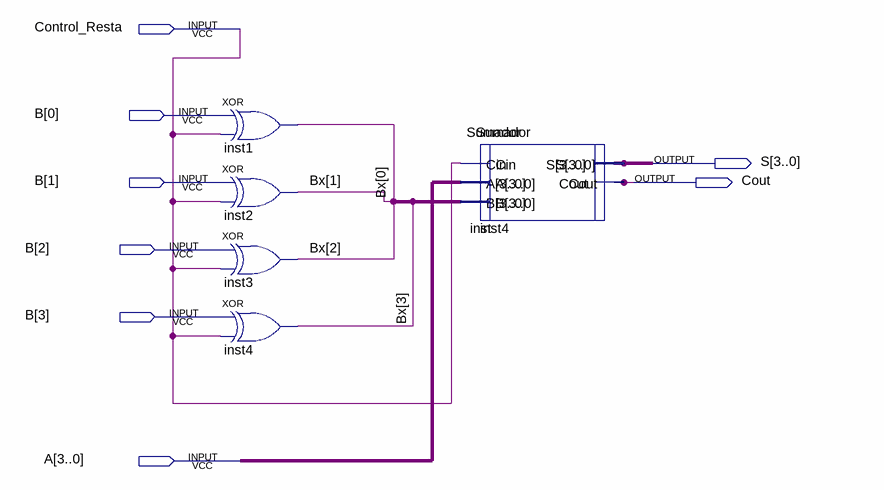
[diagram p0: schematic sheet]
// Quartus schematic Resta.bdf as structural Verilog: 6 symbols, 8 pins
module Resta (
  input  Control_Resta,
  input  [3:0] B,
  input  [3:0] A,
  output [3:0] S,
  output Cout
);

  wire [3:0] Bx, undriven;

  buf inst1 (Bx[0], Control_Resta);  // XOR open: IN1
  buf inst2 (Bx[1], Control_Resta);  // XOR open: IN1
  xor inst3 (Bx[2], B[2], Control_Resta);
  xor inst4 (Bx[3], B[3], Control_Resta);
  Sumador inst (.Cin(Control_Resta), .A(A), .B(undriven), .S(S), .Cout(Cout));
  Sumador inst4_dup2 (.S(S), .Cout(Cout));  // open: Cin, A, B
endmodule
